# EAGLE schematic GPRS-Tracker (EAGLE 9.6.2)
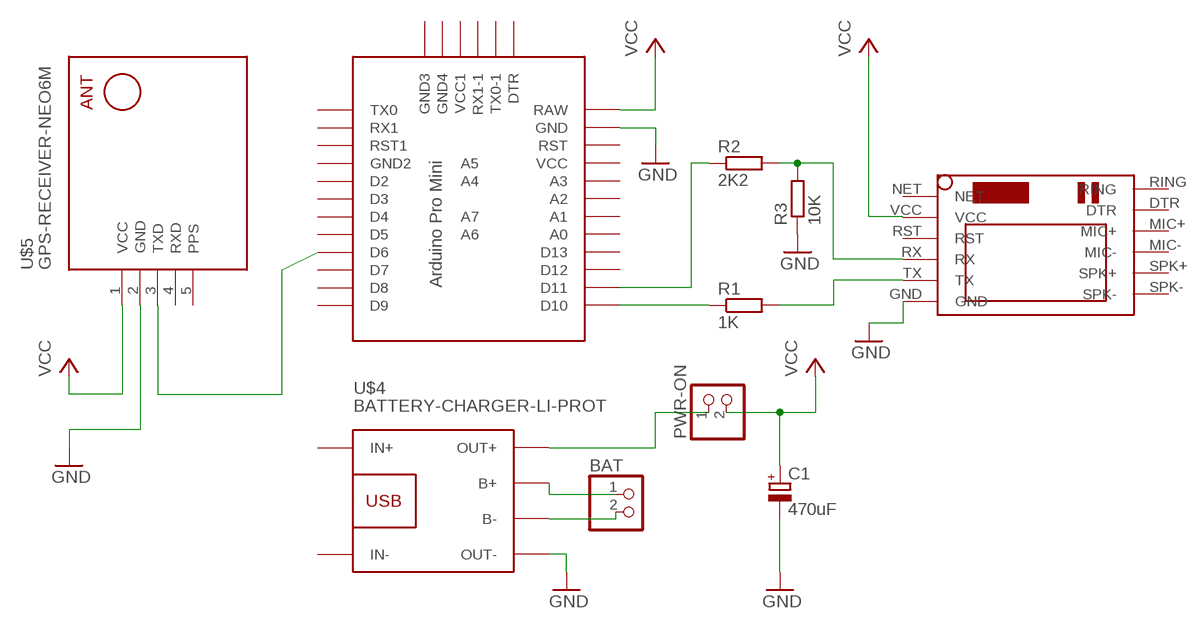
[diagram p0: schematic, sheet 1]

## Parts
BAT  PINHD-1X2  [1X02]
C1  470uF  CPOL-EUE3.5-8  [E3,5-8]
PWR-ON  PINHD-1X2  [1X02]
R1  1K  R-EU_0204/7  [0204/7]
R2  2K2  R-EU_0204/7  [0204/7]
R3  10K  R-EU_0204/7  [0204/7]
U$1  PRO-MINI-2  [PRO-MINI-2]
U$2  SIM800LMODULE  [SIM800LMODULE]
U$4  BATTERY-CHARGER-LI-PROT  [BATTERY-CHARGER-LI-PROT]
U$5  GPS-RECEIVER-NEO6M  [GPS-RECEIVER-NEO6M]

## Nets
GND: C1.- R3.1 U$1.GND U$2.GND U$4.OUT- U$5.2(GND)
N$1: U$1.D6 U$5.3(TXD)
N$2: R1.2 U$2.TX
N$3: R1.1 U$1.D10
N$4: R2.2 R3.2 U$2.RX
N$5: R2.1 U$1.D11
N$6: PWR-ON.1 U$4.OUT+
N$7: BAT.1 U$4.B+
N$8: BAT.2 U$4.B-
VCC: C1.+ PWR-ON.2 U$1.RAW U$2.VCC U$5.1(VCC)
Unconnected: U$1.A0 U$1.A1 U$1.A2 U$1.A3 U$1.A4 U$1.A5 U$1.A6 U$1.A7 U$1.D2 U$1.D3 U$1.D4 U$1.D5 U$1.D7 U$1.D8 U$1.D9 U$1.D12 U$1.D13 U$1.DTR U$1.GND1(GND2) U$1.GND2(GND3) U$1.GND3(GND4) U$1.RST U$1.RST1 U$1.RX1 U$1.RX1-1 U$1.TX0 U$1.TX0-1 U$1.VCC U$1.VCC1 U$2.DTR U$2.MIC+ U$2.MIC- U$2.NET U$2.RING U$2.RST U$2.SPK+ U$2.SPK- U$4.IN+ U$4.IN-

## Power pins joined to a net without a drawn wire
PPS: U$5.5(PPS)
RXD: U$5.4(RXD)

## Library data of the parts
BAT PWR-ON = pinhead:PINHD-1X2: PIN HEADER
C1 = rcl:CPOL-EU: POLARIZED CAPACITOR, European symbol; SPICEPREFIX: C
R1-R3 = rcl:R-EU_: RESISTOR, European symbol; SPICEPREFIX: R
U$1 = Arduino-clone:PRO-MINI-2: Arduino Pro Mini Layout 2 Sparkfun.com
U$2 = SIM800LMODULE:SIM800LMODULE: SIM800L Module
U$4 = diy-modules:BATTERY-CHARGER-LI-PROT: Lithium Battery 5V Charger with protection circuit More details available here: http://www.instructables.com/id/DIY-Lithium-ion-Battery-Charger/step4/TP4056-based-lithium-ion-battery-charger-module/ Click here to find device on ebay.com <http://www.ebay.com/sch/tp4056+charger+usb+protection>
U$5 = diy-modules:GPS-RECEIVER-NEO6M: GPS Receiver Module based on NEO-6 device Short tutorial how to use NEO-6 module with Arduino: http://www.xarg.org/2016/06/neo6mv2-gps-module-with-arduino/ NEO-6 datasheet is available here: https://www.u-blox.com/sites/default/files/products/documents/NEO-6_DataSheet_%28GPS.G6-HW-09005%29.pdf Click here to find device on ebay.com <http://www.ebay.com/sch/gyneo6mv2>

## Net classes
0 default: width 0.762 mm, clearance 0.508 mm